# Altium project DCDC.PrjPcb (part 1 of 9)
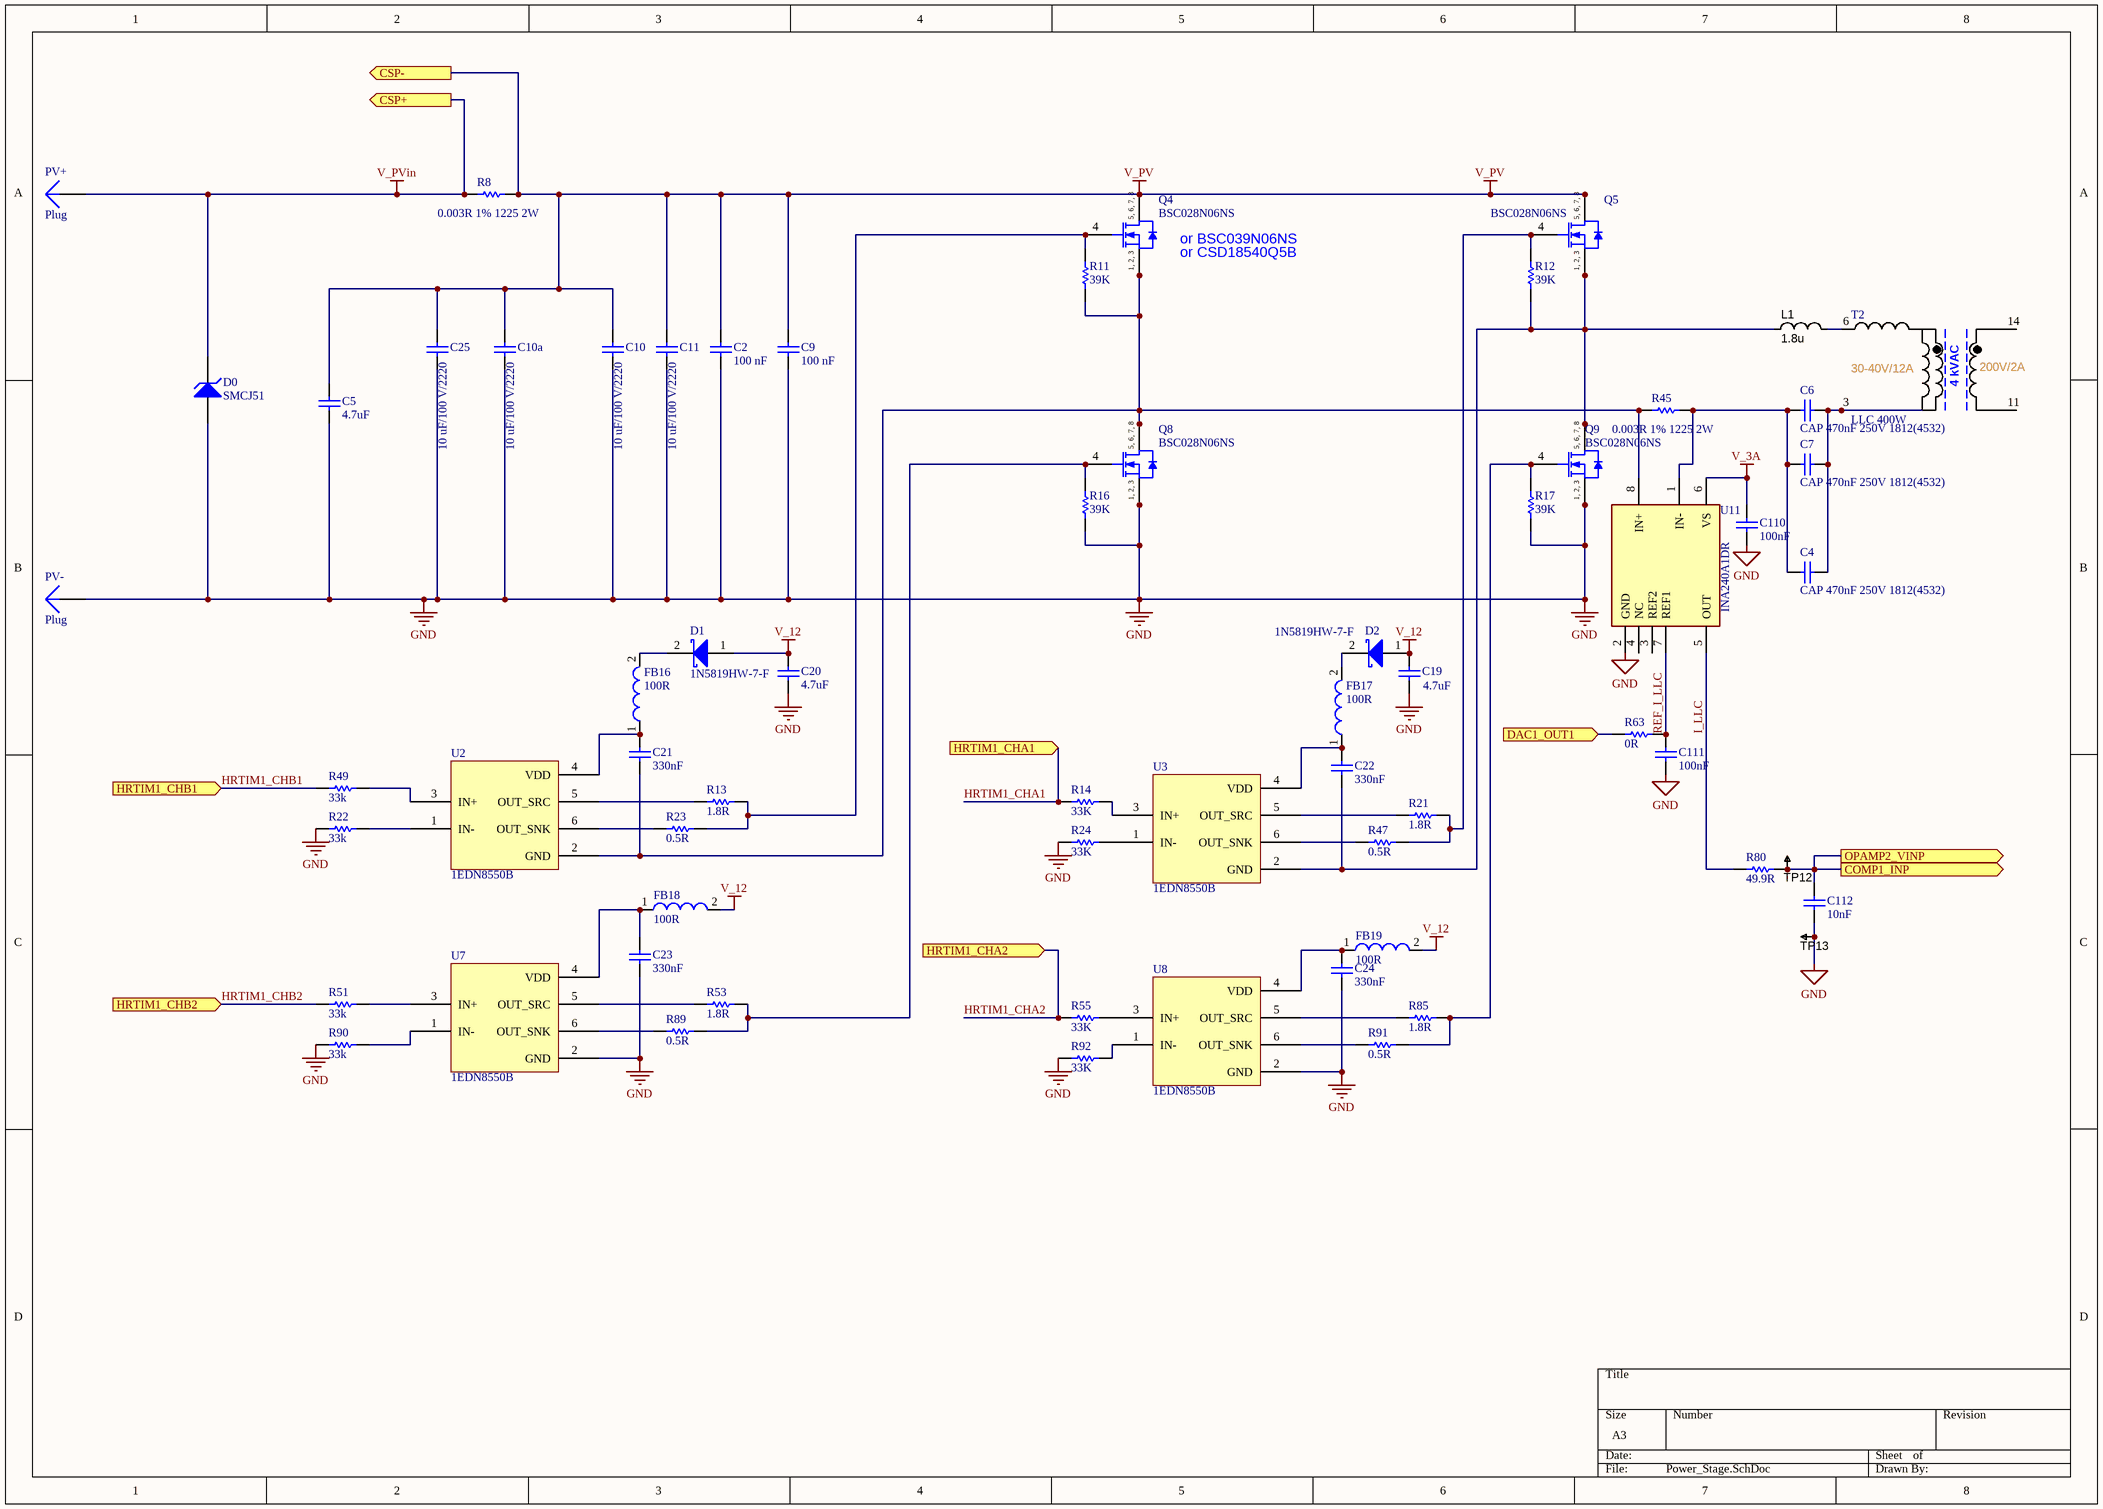
[diagram p0: Power_Stage.SchDoc]
8 sheets, 389 parts. Net scope: flat (ports and power ports of the same name join across sheets).
Board file: DCDCv1.1.PcbDoc
Sheets:
  Power_Stage.SchDoc
  MCU.SchDoc
  ISO_IO.SchDoc
  ISO_Power.SchDoc
  HV_BUCK_V2.SchDoc
  LV_BUCK.SchDoc
  CAN.SchDoc
  WIFI.SchDoc

## Sheet Power_Stage.SchDoc
size A3; SheetNumber: 1; SheetTotal: 8

### Parts
C2  100 nF  [CAPC2013X94X50NL20T25]
C4  CAP 470nF 250V 1812(4532)  [CAPC1812(4532)190_M]
C5  4.7uF  [CAPC3225X279X50NL20T25]
C6  CAP 470nF 250V 1812(4532)  [CAPC1812(4532)190_M]
C7  CAP 470nF 250V 1812(4532)  [CAPC1812(4532)190_M]
C9  100 nF  [CAPC2013X94X50NL20T25]
C10  10 uF/100 V/2220  [CAPC5750X279X64LL40T39]
C10a  10 uF/100 V/2220  [CAPC5750X279X64LL40T39]
C11  10 uF/100 V/2220  [CAPC5750X279X64LL40T39]
C19  Capacitance: 4.7uF  [CAPC3216X180X50ML20T25]  (hidden comment: C1206C105K3RACTU)
C20  Capacitance: 4.7uF  [CAPC3216X180X50ML20T25]  (hidden comment: C1206C105K3RACTU)
C21  330nF  [CAPC2013X135X45ML10T25]
C22  330nF  [CAPC2013X135X45ML10T25]
C23  330nF  [CAPC2013X135X45ML10T25]
C24  330nF  [CAPC2013X135X45ML10T25]
C25  10 uF/100 V/2220  [CAPC5750X279X64LL40T39]
C110  100nF  [CAPC1608X90X35NL10T15]
C111  100nF  [CAPC1608X90X35NL10T15]
C112  10nF  [CAPC1005X56X25NL10T15]
D0  SMCJ51  [FAIR-DO-214AB-2_V]
D1  1N5819HW-7-F  [DIOD-SOD-123-2_V]
D2  1N5819HW-7-F  [DIOD-SOD-123-2_V]
FB16  100R  [SMD-0603]
FB17  100R  [SMD-0603]
FB18  100R  [SMD-0603]
FB19  100R  [SMD-0603]
L1  1.8u  [IND LLC]
PV+  Plug  [PV_PAD]
PV-  Plug  [PV_PAD]
Q4  BSC028N06NS  [INF-PG-TDSON-8-1_V]
Q5  BSC028N06NS  [INF-PG-TDSON-8-1_V]
Q8  BSC028N06NS  [INF-PG-TDSON-8-1_V]
Q9  BSC028N06NS  [INF-PG-TDSON-8-1_V]
R8  0.003R 1% 1225 2W  [RESC3264X06N]
R11  39K  [RESC1608X55X30NL20T10]
R12  39K  [RESC1608X55X30NL20T10]
R13  1.8R  [RESC3216X70X40ML20T20]
R14  33K  [RESC1608X55X25ML10T15]
R16  39K  [RESC1608X55X30NL20T10]
R17  39K  [RESC1608X55X30NL20T10]
R21  1.8R  [RESC3216X70X40ML20T20]
R22  33k  [RESC1608X55X25ML10T15]
R23  0.5R  [RESC3216X70X40ML20T20]
R24  33K  [RESC1608X55X25ML10T15]
R45  0.003R 1% 1225 2W  [RESC3264X06N]
R47  0.5R  [RESC3216X70X40ML20T20]
R49  33k  [RESC1608X55X25ML10T15]
R51  33k  [RESC1608X55X25ML10T15]
R53  1.8R  [RESC3216X70X40ML20T20]
R55  33K  [RESC1608X55X25ML10T15]
R63  0R  [RESC1608X55X25ML10T15]
R80  49.9R  [RESC1608X55X30ML15T15]
R85  1.8R  [RESC3216X70X40ML20T20]
R89  0.5R  [RESC3216X70X40ML20T20]
R90  33k  [RESC1608X55X25ML10T15]
R91  0.5R  [RESC3216X70X40ML20T20]
R92  33K  [RESC1608X55X25ML10T15]
T2  LLC 400W  [ETD39-K-V-16P-HORIZONTAL-PRI]
TP12  TESTPOINT  [TP-R60]  (value not drawn)  (no BOM)
TP13  TESTPOINT  [TP-R60]  (value not drawn)  (no BOM)
U2  1EDN8550B  [SOT23-6]
U3  1EDN8550B  [SOT23-6]
U7  1EDN8550B  [SOT23-6]
U8  1EDN8550B  [SOT23-6]
U11  INA240A1DR  [SOIC127P600X175-8AN]

### Ports
COMP1_INP (out), CSP+ (out), CSP- (out), DAC1_OUT1 (in), HRTIM1_CHA1 (in), HRTIM1_CHA2 (in), HRTIM1_CHB1 (in), HRTIM1_CHB2 (in), OPAMP2_VINP (out)

### Nets
GND: C2.1 C5.1 C9.1 C10.1 C10a.1 C11.1 C19.1 C20.1 C23.1 C24.1 C25.1 C110.1 C111.1 C112.1 D0.1(A) PV-.1 Q8.1(SOURCE) Q8.2(SOURCE) Q8.3(SOURCE) Q9.1(SOURCE) Q9.2(SOURCE) Q9.3(SOURCE) R16.1 R17.1 R22.1 R24.1 R90.1 R92.1 TP13.1 U7.2(GND) U8.2(GND) U11.2(GND)
V_3A: C110.2 U11.6(VS)
V_12: C19.2 C20.2 D1.1(A) D2.1(A) FB18.2 FB19.2
V_PV: C2.2 C5.2 C9.2 C10.2 C10a.2 C11.2 C25.2 Q4.5(DRAIN) Q4.6(DRAIN) Q4.7(DRAIN) Q4.8(DRAIN) Q5.5(DRAIN) Q5.6(DRAIN) Q5.7(DRAIN) Q5.8(DRAIN) R8.2 ; port CSP-
V_PVin: D0.2(K) PV+.1 R8.1 ; port CSP+
COMP1_INP: C112.2 R80.2 TP12.1 ; port OPAMP2_VINP, port COMP1_INP
DAC1_OUT1: R63.1 ; port DAC1_OUT1
HRTIM1_CHA1: R14.1 ; port HRTIM1_CHA1
HRTIM1_CHA2: R55.1 ; port HRTIM1_CHA2
HRTIM1_CHB1: R49.1 ; port HRTIM1_CHB1
HRTIM1_CHB2: R51.1 ; port HRTIM1_CHB2
I_LLC: R80.1 U11.5(OUT)
REF_I_LLC: C111.2 R63.2 U11.7(REF1)
NetC4_1: C4.1 C6.1 C7.1 R45.2 U11.1(IN-)
NetC4_2: C4.2 C6.2 C7.2 T2.3
NetC21_1: C21.1 Q4.1(SOURCE) Q4.2(SOURCE) Q4.3(SOURCE) Q8.5(DRAIN) Q8.6(DRAIN) Q8.7(DRAIN) Q8.8(DRAIN) R11.1 R45.1 U2.2(GND) U11.8(IN+)
NetC21_2: C21.2 FB16.1 U2.4(VDD)
NetC22_1: C22.1 L1.1 Q5.1(SOURCE) Q5.2(SOURCE) Q5.3(SOURCE) Q9.5(DRAIN) Q9.6(DRAIN) Q9.7(DRAIN) Q9.8(DRAIN) R12.1 U3.2(GND)
NetC22_2: C22.2 FB17.1 U3.4(VDD)
NetC23_2: C23.2 FB18.1 U7.4(VDD)
NetC24_2: C24.2 FB19.1 U8.4(VDD)
NetD1_2: D1.2(K) FB16.2
NetD2_2: D2.2(K) FB17.2
NetL1_2: L1.2 T2.6
NetQ4_4: Q4.4(GATE) R11.2 R13.2 R23.2
NetQ5_4: Q5.4(GATE) R12.2 R21.2 R47.2
NetQ8_4: Q8.4(GATE) R16.2 R53.2 R89.2
NetQ9_4: Q9.4(GATE) R17.2 R85.2 R91.2
NetR13_1: R13.1 U2.5(OUT_SRC)
NetR14_2: R14.2 U3.3(IN+)
NetR21_1: R21.1 U3.5(OUT_SRC)
NetR22_2: R22.2 U2.1(IN-)
NetR23_1: R23.1 U2.6(OUT_SNK)
NetR24_2: R24.2 U3.1(IN-)
NetR47_1: R47.1 U3.6(OUT_SNK)
NetR49_2: R49.2 U2.3(IN+)
NetR51_2: R51.2 U7.3(IN+)
NetR53_1: R53.1 U7.5(OUT_SRC)
NetR55_2: R55.2 U8.3(IN+)
NetR85_1: R85.1 U8.5(OUT_SRC)
NetR89_1: R89.1 U7.6(OUT_SNK)
NetR90_2: R90.2 U7.1(IN-)
NetR91_1: R91.1 U8.6(OUT_SNK)
NetR92_2: R92.2 U8.1(IN-)

Not connected (* = marked no-connect by the designer): T2 11 14; U11 3(REF2) 4(NC)

### Notes on the sheet
- (near Q4) or BSC039N06NS
- (near Q4) or CSD18540Q5B
- (in symbol CMP-1091-00043-1) 5, 6, 7, 8; 1, 2, 3
- (in symbol TI-ETD39-200V-2A-LLC) 30-40V/12A; 200V/2A; 4 kVAC

### Library data of the parts
C2 C9 = CMP-1036-04427-2: X7R 100nF ±10% 100V 0805 Multilayer Ceramic Capacitors MLCC - SMD/SMT ROHS; Manufacturer: AVX Interconnect / Elco; Part Number: 08051C104JAT2A; Manufacturer Part Number: CL21B104KCFNNNE; Tolerance: 5%; Dissipation Factor: 2.5%; Supplier 1: RSComponents; Supplier Part Number 1: 1356664; RoHS: Yes; Category: Ceramic Capacitors; Stock 1: 1; Pricing 1: 100=0.13700, 500=0.12500, 1000=0.11100 (USD); Mount: Surface Mount; Case/Package: 0805; Number of Pins: 2; Case Code (Metric): 2012; Case Code (Imperial): 0805; Min Operating Temperature: -55°C; Max Operating Temperature: 125°C; Package Quantity: 1; Capacitance: 100nF; Voltage Rating: 100V; Packaging: Tape and Reel; Voltage Rating (DC): 100V; Dielectric: X7R; Series: -; Termination: SMD/SMT; Construction: Flat; Voltage: 100V; Length: 2.01mm; Width: 0.049inch; Height: 1.4mm; Thickness: 0.055inch; Depth: 1.25mm; Radiation Hardening: No; RoHS Compliant: Yes; REACH SVHC: No SVHC; Lead Free: Lead Free; ComponentLink1URL: https://datasheet.ciiva.com/152/cx7r-152288.pdf?src-supplier=Digi-Key; ComponentLink1Description: https://datasheet.ciiva.com/152/cx7r-152288.pdf?src-supplier=Digi-Key; ComponentLink2URL: https://datasheet.ciiva.com/152/cx7r-152289.pdf?src-supplier=Digi-Key; ComponentLink2Description: https://datasheet.ciiva.com/152/cx7r-152289.pdf?src-supplier=Digi-Key; ComponentLink3URL: https://datasheet.ciiva.com/11504/cx7r-11504232.pdf?src-supplier=Avnet; ComponentLink3Description: https://datasheet.ciiva.com/11504/cx7r-11504232.pdf?src-supplier=Avnet; ComponentLink4URL: https://datasheet.ciiva.com/16326/cx7r-16326744.pdf?src-supplier=Future+Electronics; ComponentLink4Description: https://datasheet.ciiva.com/16326/cx7r-16326744.pdf?src-supplier=Future+Electronics; ComponentLink5URL: https://datasheet.ciiva.com/22676/1679506-22676600.pdf?src-supplier=Element14; ComponentLink5Description: https://datasheet.ciiva.com/22676/1679506-22676600.pdf?src-supplier=Element14; ComponentLink6URL: https://datasheet.ciiva.com/5427/cx7r-218113-5427354.pdf?src-supplier=Mouser; ComponentLink6Description: https://datasheet.ciiva.com/5427/cx7r-218113-5427354.pdf?src-supplier=Mouser; ComponentLink7URL: https://datasheet.ciiva.com/16625/cx7r-16625228.pdf?src-supplier=Avnet+Europe; ComponentLink7Description: https://datasheet.ciiva.com/16625/cx7r-16625228.pdf?src-supplier=Avnet+Europe; ComponentLink8URL: https://datasheet.ciiva.com/152/cx7r-152287.pdf?src-supplier=Digi-Key; ComponentLink8Description: https://datasheet.ciiva.com/152/cx7r-152287.pdf?src-supplier=Digi-Key; ComponentLink9URL: https://datasheet.ciiva.com/28613/1679506-28613087.pdf?src-supplier=Element14; ComponentLink9Description: https://datasheet.ciiva.com/28613/1679506-28613087.pdf?src-supplier=Element14; JLCPCB Part #: C28233; Parameter 1: *
C4 C6 C7 = CMP-1040-01559-1: CAP 470nF 250V ±10% 1812 (4532 Metric) Thickness 1.9mm SMD; Case-Metric: 4532; Case-EIA: 1812; Tolerance: Â±10%; Max Thickness: 1.9 mm; Technology: SMT; Rated Voltage: 250 V; Value: 470nF; Parameter 1: *; JLCPCB Part #: *
C5 = CMP-2000-05478-1: Ceramic Capacitor, 100 V, 4.7 uF, +/-10%, -55 to 85 degC, 2-Pin SMD (1210), RoHS, Tape and Reel; Temperature Coefficient / Code: +/-15%; Case Height: 2.79mm; Brand: AVX; Case Width: 2.5mm; Tolerance: 10%; Capacitance: 22uF; Voltage Rating: 25V; Dielectric: X5R; Case Length: 3.2mm; Type: StandardX5RMLCCs; Case Code - in: 1210; Packaging: Reel; Minimum Operating Temperature: -55C; Package Reference: 1210; Product Category: MultilayerCeramicCapacitorsMLCC-SMD/SMT; Package / Case: 1210(3225metric); Dimensions: 2.5mmWx3.2mmLx2.79mmH; RoHS: Details; Manufacturer: AVX; Case Code - mm: 3225; Maximum Operating Temperature: +85C; Operating Temperature Range: -55Cto+85C; Mounting Technology: SurfaceMount; Product: GeneralTypeMLCCs; Manufacturer URL: http://www.avx.com/; Termination Style: SMD/SMT; Package Description: 2-Pin Surface Mount Device, Body 3.2 x 2.5 mm; Datasheet URL: http://datasheets.avx.com/cx5r.pdf; Datasheet Version: 05/2016; Voltage Rating DC: 25V; Factory Pack Quantity: 1000; Parameter 1: *; JLCPCB Part #: *
C10 C10a C11 C25 = CMP-2000-07534-1: Chip Capacitor, 10 uF, +/- 20%, 100 V, -55 to 125 degC, 2220 (5750 Metric), RoHS, Tape and Reel; Manufacturer: AVX; Manufacturer Part Number: 22201C106MAT2A; Capacitance: 10uF; Voltage Rating: 100V; Dielectric: X7R; Datasheet URL: http://datasheets.avx.com/X7RDielectric.pdf; Package Reference: 2220; Package Description: 2-Pin Surface Mount Device, Body 5 x 5.7 mm; Datasheet Version: 03/2017; Manufacturer URL: http://www.avx.com/; Mounting Technology: SurfaceMount; Supplier 1: Digi-Key; Supplier Part Number 1: 478-9622-1-ND; Stock 1: 129916; Pricing 1: 1=2,26000, 10=1,82600, 100=1,39470 (USD); RoHS: Yes; Mount: Surface Mount; Case/Package: 2220; Case Code (Metric): 5750; Case Code (Imperial): 2220; Min Operating Temperature: -55°C; Max Operating Temperature: 125°C; Packaging: Tape and Reel; Tolerance: 20%; Voltage Rating (DC): 100V; Length: 0.224inch; Width: 0.197inch; Thickness: 0.11inch; ComponentLink1URL: http://catalogs.avx.com/SurfaceMount.pdf?src-supplier=Digi-Key; ComponentLink1Description: http://catalogs.avx.com/SurfaceMount.pdf?src-supplier=Digi-Key; Parameter 1: *; JLCPCB Part #: *
C19 C20 = CMP-2000-04991-1: X7R ±10% 50V 4.7uF 1206 Multilayer Ceramic Capacitors MLCC - SMD/SMT ROHS; Manufacturer: Kemet; Temperature Coefficient / Code: +/-15%; Voltage Rating DC: 25V; Capacitance - nF: 1000nF; Class: Class1; Case Length: 3.2mm; Type: SMDMLCCX7R6.3-250VDCCommericalGrade; Case Width: 1.6mm; Product: GeneralTypeMLCCs; Dielectric: X7R; Datasheet URL: https://ciiva.com/datasheet-click-18194173?src=ciiva&sig=6daff8c4; Operating Temperature Range: -55Cto+125C; Series: C1206C; RoHS: Details; Product Category: MultilayerCeramicCapacitorsMLCC-SMD/SMT; Manufacturer URL: http://www.kemet.com/; Minimum Operating Temperature: -55C; Dimensions: 1.6mmWx3.2mmLx1.6mmH; Termination Style: SMD/SMT; Brand: Kemet; Packaging: Reel; Package / Case: 1206(3216metric); Case Code - mm: 3216; Datasheet Version: Jul-14; Factory Pack Quantity: 2000; Package Description: 2-Pin Surface Mount Device, Body 3.2 x 1.6 mm; Tolerance: 10%; Package Reference: 1206; Case Height: 1.6mm; Case Code - in: 1206; Maximum Operating Temperature: +125C; Voltage Rating: 25V; Parameter 1: *; JLCPCB Part #: C29823
C21-C24 = CMP-2100-03644-1: X7R ±10% 50V 330nF 0805 Multilayer Ceramic Capacitors MLCC - SMD/SMT ROHS; Manufacturer: Murata; Manufacturer Part Number: GRM21BR71H104KA01L; Capacitance: 100nF; Insulation Resistance: 10GR; Package Description: 2-Pin Surface Mount Device, Body 2 x 1.25 mm; Manufacturer URL: http://www.murata.com/; Case Code (Imperial): 0805; Voltage: 50V; Datasheet URL: http://psearch.en.murata.com/capacitor/product/GRM21BR71H104KA01%23.pdf; Termination: SMD/SMT; Lead Free: LeadFree; Package Quantity: 1; Mount: SurfaceMount; REACH SVHC: Unknown; Thickness: 0.053inch; Height: 1.25mm; Case/Package: 0805; Voltage Rating: 50V; Dielectric Material: Ceramic; Width: 0.049inch; Case Code (Metric): 2012; Material: Ceramic; Min Operating Temperature: -55degC; RoHSCompliant: true; Datasheet Version: 42675.0; Voltage Rating (DC): 50V; Tolerance: 10%; Dielectric: X7R; Package Reference: 0805; Depth: 1.25mm; Length: 2mm; Max Operating Temperature: 125degC; Packaging: TapeandReel; Number of Pins: 2; Radiation Hardening: No; Supplier 1: Farnell; Supplier Part Number 1: 2408531; RoHS: Yes; Category: Ceramic Capacitors; Stock 1: 576000; ComponentLink1URL: https://datasheet.ciiva.com/11786/0900766b8003061f-11786305.pdf?src-supplier=RSComponents; ComponentLink1Description: https://datasheet.ciiva.com/11786/0900766b8003061f-11786305.pdf?src-supplier=RSComponents; ComponentLink2URL: https://datasheet.ciiva.com/20173/71-2024-20173169.pdf?src-supplier=Rapid+Electronics; ComponentLink2Description: https://datasheet.ciiva.com/20173/71-2024-20173169.pdf?src-supplier=Rapid+Electronics; ComponentLink3URL: https://datasheet.ciiva.com/29200/453120-da-01-en-vs-kondensator-0805-29200537.pdf?src-supplier=Conrad; ComponentLink3Description: https://datasheet.ciiva.com/29200/453120-da-01-en-vs-kondensator-0805-29200537.pdf?src-supplier=Conrad; ComponentLink4URL: https://datasheet.ciiva.com/132/partnumbering-e-01-132209.pdf?src-supplier=Digi-Key; ComponentLink4Description: https://datasheet.ciiva.com/132/partnumbering-e-01-132209.pdf?src-supplier=Digi-Key; ComponentLink5URL: https://datasheet.ciiva.com/132/partnumbering-e-01-132210.pdf?src-supplier=Digi-Key; ComponentLink5Description: https://datasheet.ciiva.com/132/partnumbering-e-01-132210.pdf?src-supplier=Digi-Key; ComponentLink6URL: https://datasheet.ciiva.com/132/partnumbering-e-01-132211.pdf?src-supplier=Digi-Key; ComponentLink6Description: https://datasheet.ciiva.com/132/partnumbering-e-01-132211.pdf?src-supplier=Digi-Key; ComponentLink7URL: https://datasheet.ciiva.com/7937/1794405-7937708.pdf?src-supplier=Element14; ComponentLink7Description: https://datasheet.ciiva.com/7937/1794405-7937708.pdf?src-supplier=Element14; ComponentLink8URL: https://datasheet.ciiva.com/7937/1794405-7937709.pdf?src-supplier=Element14; ComponentLink8Description: https://datasheet.ciiva.com/7937/1794405-7937709.pdf?src-supplier=Element14; ComponentLink9URL: https://datasheet.ciiva.com/28534/1769893-28534317.pdf?src-supplier=Element14; ComponentLink9Description: https://datasheet.ciiva.com/28534/1769893-28534317.pdf?src-supplier=Element14; ComponentLink10URL: https://datasheet.ciiva.com/7937/4360-7937710.pdf?src-supplier=Element14; ComponentLink10Description: https://datasheet.ciiva.com/7937/4360-7937710.pdf?src-supplier=Element14; Parameter 1: *; JLCPCB Part #: C1740
C110 C111 = CAP: X7R 100nF ±10% 50V 0603 Multilayer Ceramic Capacitors MLCC - SMD/SMT ROHS; Part Number: GCM188R72A104KA64D; Manufacturer: Murata; Manufacturer Part Number: CC0603KRX7R9BB104; Voltage Rating: 100V; Supplier 1: Arrow Electronics; Supplier Part Number 1: GCM188R72A104KA64D; RoHS: Yes; Category: Ceramic Capacitors; Mount: Surface Mount; Case/Package: 0603; Case Code (Imperial): 0603; Case Code (Metric): 1608; Min Operating Temperature: -55°C; Max Operating Temperature: 125°C; Tolerance: 10%; Packaging: Tape and Reel; Capacitance: 100nF; Dielectric: X7R; Termination: SMD/SMT; Voltage Rating (DC): 100V; Length: 1.6mm; Height: 0.8mm; Depth: 0.8mm; Radiation Hardening: No; ComponentLink1URL: https://datasheet.ciiva.com/17451/product-17451047.pdf?src-supplier=Avnet+Europe; ComponentLink1Description: https://datasheet.ciiva.com/17451/product-17451047.pdf?src-supplier=Avnet+Europe; ComponentLink2URL: https://datasheet.ciiva.com/26889/getdatasheetpartid-387765-26889164.pdf?src-supplier=Verical; ComponentLink2Description: https://datasheet.ciiva.com/26889/getdatasheetpartid-387765-26889164.pdf?src-supplier=Verical; Parameter 1: *; JLCPCB Part #: C14663
C112 = CAP: X7R ±10% 50V 10nF 0603 Multilayer Ceramic Capacitors MLCC - SMD/SMT ROHS; Manufacturer: AVX Interconnect / Elco; Part Number: 04023C103JAT2A; Tolerance: 5%; Voltage Rating: 25V; Supplier 1: Digi-Key; Supplier Part Number 1: 478-7867-1-ND; Manufacturer Part Number: 04023C103JAT2A; RoHS: Yes; Category: Ceramic Capacitors; Stock 1: 9159; Pricing 1: 1=0.35000, 10=0.24300, 50=0.16980, 100=0.14560, 500=0.10920, 1000=0.09221, 2500=0.08735, 5000=0.08250 (USD); Mount: Surface Mount; Case/Package: 0402; Number of Pins: 2; Case Code (Imperial): 0402; Case Code (Metric): 1005; Min Operating Temperature: -55°C; Max Operating Temperature: 125°C; Packaging: Tape and Reel; Capacitance: 10nF; Package Quantity: 1; Voltage Rating (DC): 25V; Dielectric: X7R; Termination: SMD/SMT; Series: -; Construction: Flat; Length: 1mm; Width: 0.5mm; Thickness: 0.022inch; Depth: 0.5mm; Radiation Hardening: No; RoHS Compliant: Yes; Lead Free: Lead Free; ComponentLink1URL: https://datasheet.ciiva.com/11499/cx7r-11499815.pdf?src-supplier=Avnet; ComponentLink1Description: https://datasheet.ciiva.com/11499/cx7r-11499815.pdf?src-supplier=Avnet; ComponentLink2URL: https://datasheet.ciiva.com/5424/cx7r-218113-5424201.pdf?src-supplier=Mouser; ComponentLink2Description: https://datasheet.ciiva.com/5424/cx7r-218113-5424201.pdf?src-supplier=Mouser; ComponentLink3URL: https://datasheet.ciiva.com/7614/cx7r-7614730.pdf?src-supplier=Digi-Key; ComponentLink3Description: https://datasheet.ciiva.com/7614/cx7r-7614730.pdf?src-supplier=Digi-Key; ComponentLink4URL: https://datasheet.ciiva.com/208/cx7r-208205.pdf?src-supplier=Digi-Key; ComponentLink4Description: https://datasheet.ciiva.com/208/cx7r-208205.pdf?src-supplier=Digi-Key; ComponentLink5URL: https://datasheet.ciiva.com/14906/cx7r-14906237.pdf?src-supplier=Digi-Key; ComponentLink5Description: https://datasheet.ciiva.com/14906/cx7r-14906237.pdf?src-supplier=Digi-Key; ComponentLink6URL: https://datasheet.ciiva.com/16397/cx7r-16397645.pdf?src-supplier=Future+Electronics; ComponentLink6Description: https://datasheet.ciiva.com/16397/cx7r-16397645.pdf?src-supplier=Future+Electronics; ComponentLink7URL: https://datasheet.ciiva.com/14906/cx7r-14906238.pdf?src-supplier=Digi-Key; ComponentLink7Description: https://datasheet.ciiva.com/14906/cx7r-14906238.pdf?src-supplier=Digi-Key; Parameter 1: *; JLCPCB Part #: C57112
D0 = CMP-2000-07108-1: Transient Voltage Suppressor, 1500 W, 36 V, 2-Pin SMD, RoHS, Tape and Reel; Manufacturer: Fairchild Semiconductor; Breakdown Voltage-Max: 44.2V; Directional: Uni-Directional; Clamping Voltage-Max: 58.1V; Power Dissipation: 1500W; Breakdown Voltage-Min: 40V; Datasheet Version: Rev. 5.7, 09/2015; Mounting Technology: SurfaceMount; Package Description: 2-Pin Surface Mount Device, Body 6.875 x 5.9 mm; Package Reference: DO-214AB; Manufacturer URL: https://www.fairchildsemi.com/; Datasheet URL: https://www.fairchildsemi.com/datasheets/SM/SMCJ36A.pdf; Parameter 1: *; JLCPCB Part #: *
D1 D2 = CMP-0303-00003-1: 1.0 A Surface Mount Schottky Barrier Rectifier, 40 V, -65 to 125 degC, 2-Pin SOD-123 Package, RoHS, Tape and Reel; Manufacturer: Diodes Inc; @ VR (V): 40; @ Terminal Temperature TT (degC): 90; Maximum Average Rectified Current IO (A): 1; Total Capacitance CT (pF): 50; Peak Forward Surge Current IFSM (A): 25; Forward Voltage Drop VF (V): 0.45; VR (RMS) (V): 28; RoHS: TRUE; PartNumber: 1N5819HW-7-F; ComponentLink2URL: http://www.diodes.com/datasheets/ds30217.pdf; PackageDescription: 2-Pin SOD-123, Body 2.7 x 1.55 mm, Pitch 3.7 mm; @ IF (A): 1; Operating and Storage Temperature Range: -65 to 125 degC; ComponentLink1Description: Manufacturer URL; ComponentLink2Description: Datasheet; ComponentLink1URL: http://www.diodes.com/; Mounting Technology: Surface Mount; DatasheetVersion: Rev. 15-2; PackageReference: SOD-123-2; Maximum Reverse Current IR (uA): 50; Peak Repetitive Reverse Voltage VRRM (V): 40; Packing: Tape and Reel; Parameter 1: *; JLCPCB Part #: C8598
FB16-FB19 = CMP-0220-00115-1: SMD EMI Suppression Ferrite Bead WE-CBF, Z = 1500 Ohm; DatasheetVersion: Dec-2005; ComponentLink1URL: http://www.we-online.com; PackageVersion: 2009; PackageDescription: Chip Inductor, 2-Leads, Body 1.6 x 0.8 mm; ComponentLink2URL: http://www.we-online.de/katalog/media/pdf/742792691.pdf; ComponentLink1Description: Manufacturer Link; ComponentLink2Description: Datasheet; Impedance: 1500 Ohm; PackageReference: SMD-0603; Parameter 1: *; JLCPCB Part #: *
L1 = INDC_150n_1008: Inductor SMD chip 150nH 1008; Manufacturer 1: TDK Corporation; Manufacturer Part Number 1: NLV25T-R15J-PF; Ratings: 500 mA; Tolerance: ±5%; SCDType: spec; Package / Case: 1008 (2520 Metric); Supplier 1: Digi-Key; Supplier Part Number 1: 445-1715-1-ND; Value: 1.8u; Parameter 1: *; JLCPCB Part #: *
PV+ = Plug: System: Connector; LatestRevisionDate: 17-Jul-2002; LatestRevisionNote: Re-released for DXP Platform.; Publisher: Altium Limited; Parameter 1: *; JLCPCB Part #: *
Q4 Q5 Q8 Q9 = CMP-1091-00043-1: N-Channel OptiMOS Power-Transistor, 60 V VDS, 100 A ID, -55 to 150 degC, PG-TDSON-8-1, Reel, Green; PartNumber: BSC027N06LS5; Manufacturer: Infineon; Green: TRUE; ID (max): 100Â A; RthJA (max): 50 K/W; IDpuls (max): 400Â A; VGS(th) (min): 2.1Â V; Ptot (max): 83Â W; RthJC (max): 1.5Â K/W; VDS (max): 60Â V; Polarity: N; QG: 37Â nC; VGS(th) (max): 3.3 V; RDS (on) (max): 2.8Â mOhm; ComponentLink3Description: Package Specification; ComponentLink2URL: http://www.infineon.com/dgdl/BSC028N06NS_Rev2.1.pdf?folderId=db3a30431ddc9372011ebafa04517f8b&fileId=db3a3043345a30bc013465d221bd62f9; Packing: Reel; PackageReference: PG-TDSON-8-1; PackageDescription: 8-Pin Plastic (Green) Thin Dual Small Outline Non-Leaded Package, 5.15 x 5.9 mm Body, 1.27 mm Pitch; ComponentLink1Description: Manufacturer URL; ComponentLink1URL: http://www.infineon.com/; DatasheetVersion: Rev. 2.1; Mounting Technology: Surface Mount; ComponentLink2Description: Datasheet; ComponentLink3URL: http://www.infineon.com/cms/packages/SMD_-_Surface_Mounted_Devices/P-PG-TDSON/P-PG-TDSON-08-01x_2x_3.html?__locale=en; Halogen-free: TRUE; Rth: 1.5Â K/W; Parameter 1: *; JLCPCB Part #: *
R8 R45 = RES: RES SMD 3 MOHM 3W 2512 WIDE; Manufacturer: Susumu; Manufacturer Part Number: KRL6432E-M-R003-F-T1; Resistance: 3mR; Temperature Coefficient: 50ppm/°C; Supplier 1: Digi-Key; Supplier Part Number 1: 408-1613-1-ND; RoHS: Yes; Category: Chip SMD Resistors; Stock 1: 10436; Pricing 1: 1=0.96000, 10=0.85300, 25=0.78360, 50=0.71500, 100=0.61880, 250=0.52252, 500=0.44000 (USD); Case/Package: 2512; Weight: 0.001429oz; Case Code (Imperial): 2512; Case Code (Metric): 6432; Min Operating Temperature: -55°C; Max Operating Temperature: 155°C; Power Rating: 3W; Tolerance: 1%; Packaging: Tape and Reel; Package Quantity: 1000; Termination: SMD/SMT; Composition: Metal Foil; Length: 6.3mm; Height: 0.5mm; Width: 3.1mm; ComponentLink1URL: http://www.mouser.com/ds/2/392/n_catalog_partition19_en-1114600.pdf?src-supplier=Mouser; ComponentLink1Description: http://www.mouser.com/ds/2/392/n_catalog_partition19_en-1114600.pdf?src-supplier=Mouser; ComponentLink2URL: http://www.susumu-usa.com/pdf/Foot_Print_21.pdf?src-supplier=Digi-Key; ComponentLink2Description: http://www.susumu-usa.com/pdf/Foot_Print_21.pdf?src-supplier=Digi-Key; ComponentLink3URL: http://www.susumu.co.jp/common/pdf/n_catalog_partition19_en.pdf?src-supplier=Digi-Key; ComponentLink3Description: http://www.susumu.co.jp/common/pdf/n_catalog_partition19_en.pdf?src-supplier=Digi-Key; Parameter 1: *; JLCPCB Part #: *
R11 R12 R16 R17 = CMP-2000-01851-1: ±1% 39kΩ ±100ppm/℃ 0.1W 0603 Chip Resistor - Surface Mount ROHS; Part Number: RK73B1JTTD103J; Manufacturer: KOA Speer; Resistance: 10kR; Tolerance: 5%; Power Rating: 100mW; Temperature Coefficient: 200ppm/°C; Voltage Rating: 50V; Supplier 1: Digi-Key; Supplier Part Number 1: 2019-RK73B1JTTD103JCT-ND; Manufacturer Part Number: RK73B1JTTD103J; Stock 1: 652898; Pricing 1: 1=0,10000, 10=0,01500, 100=0,00610, 1000=0,00275, 2500=0,00239 (USD); RoHS: Yes; Case/Package: 0603; Number of Pins: 2; Case Code (Imperial): 0603; Case Code (Metric): 1608; Min Operating Temperature: -55°C; Max Operating Temperature: 155°C; Packaging: Tape and Reel; Composition: Thick Film; Termination: SMD/SMT; Military Standard: Not; Package Quantity: 5000; Voltage Rating (DC): 50V; Length: 1.6mm; Height: 0.45mm; Depth: 0.8mm; Width: 0.8mm; Lead Free: Lead Free; ComponentLink1URL: https://datasheet.ciiva.com/34302/1877832-34302947.pdf?src-supplier=Jameco; ComponentLink1Description: https://datasheet.ciiva.com/34302/1877832-34302947.pdf?src-supplier=Jameco; ComponentLink2URL: https://datasheet.ciiva.com/5554/rk73b-5554408.pdf?src-supplier=Mouser; ComponentLink2Description: https://datasheet.ciiva.com/5554/rk73b-5554408.pdf?src-supplier=Mouser; ComponentLink3URL: https://datasheet.ciiva.com/7773/548635-7773278.pdf?src-supplier=Element14; ComponentLink3Description: https://datasheet.ciiva.com/7773/548635-7773278.pdf?src-supplier=Element14; Parameter 1: *; JLCPCB Part #: C23153
R13 R21 R23 R47 R53 R85 R89 R91 = CMP-2003-00929-1: Manufacturer: KOA Speer; Part Number: RK73B2BTTD4R7J; Parameter 1: *; JLCPCB Part #: *
R14 R22 R24 R49 R51 R55 R90 R92 = CMP-2100-03663-1: Chip Resistor, 100 Ohm, +/- 1%, 0.1 W, -55 to 155 degC, 0603 (1608 Metric), RoHS, Tape and Reel; Manufacturer: Yageo; Manufacturer Part Number: RC0603FR-07100RL; Voltage Rating (DC): 50V; Power Rating: 100mW; Resistance: 100Ohm; Temperature Coefficient: 100ppm/degreesC; Number of Pins: 2; Tolerance: 1%; Height: 0.45mm; Manufacturer URL: http://www.yageo.com/; Military Standard: Not; Datasheet URL: http://www.yageo.com/NewPortal/yageodocoutput?fileName=/pdf/R-Chip/PYu-RC_Group_51_RoHS_L_5.pdf; Case Code (Imperial): 0603; Termination: SMD/SMT; Lead Free: LeadFree; Max Operating Temperature: 155degC; Case Code (Metric): 1608; RoHSCompliant: true; Voltage Rating: 50V; Width: 0.8mm; Composition: ThickFilm; Depth: 0.8mm; REACH SVHC: Unknown; Min Operating Temperature: -55degC; Packaging: TapeandReel; Package Description: 2-Pin Surface Mount Device, Body 1.6 x 0.8 mm; Length: 1.6mm; Package Reference: 0603; Datasheet Version: Rev. 5, 10/2016; Case/Package: 0603; Supplier 1: Digi-Key; Supplier Part Number 1: 311-100HRDKR-ND; RoHS: Yes; Category: Chip SMD Resistors; Stock 1: 21618328; Pricing 1: 1=0.10000, 10=0.02300, 100=0.00940, 1000=0.00421, 2500=0.00366 (USD); ComponentLink1URL: https://datasheet.ciiva.com/7660/38590-7660788.pdf?src-supplier=Element14; ComponentLink1Description: https://datasheet.ciiva.com/7660/38590-7660788.pdf?src-supplier=Element14; ComponentLink2URL: https://datasheet.ciiva.com/11808/0900766b80f96399-11808280.pdf?src-supplier=RSComponents; ComponentLink2Description: https://datasheet.ciiva.com/11808/0900766b80f96399-11808280.pdf?src-supplier=RSComponents; ComponentLink3URL: https://datasheet.ciiva.com/46440/1868787-46440890.pdf?src-supplier=Element14; ComponentLink3Description: https://datasheet.ciiva.com/46440/1868787-46440890.pdf?src-supplier=Element14; ComponentLink4URL: https://datasheet.ciiva.com/7746/1738695-7746237.pdf?src-supplier=Element14; ComponentLink4Description: https://datasheet.ciiva.com/7746/1738695-7746237.pdf?src-supplier=Element14; ComponentLink5URL: https://datasheet.ciiva.com/7746/1738695-7746238.pdf?src-supplier=Element14; ComponentLink5Description: https://datasheet.ciiva.com/7746/1738695-7746238.pdf?src-supplier=Element14; ComponentLink6URL: https://datasheet.ciiva.com/22747/443971-22747518.pdf?src-supplier=Element14; ComponentLink6Description: https://datasheet.ciiva.com/22747/443971-22747518.pdf?src-supplier=Element14; Parameter 1: *; JLCPCB Part #: *
R63 = CMP-2100-03667-1: ±1% 0Ω 0.1W 0603 Chip Resistor - Surface Mount ROHS; Manufacturer: Yageo; Temperature Coefficient: 200ppm/degreesC; Tolerance: 5%; Voltage Rating: 50V; Power Rating: 100mW; Resistance: 0mOhm; Width: 0.8mm; Max Operating Temperature: 155degC; Package Reference: 0603; Height: 0.45mm; Depth: 0.8mm; Package Description: 2-Pin Surface Mount Device, Body 1.6 x 0.8 mm; Termination: SMD/SMT; Package Quantity: 5000; Case/Package: 0603; Case Code (Imperial): 0603; Radiation Hardening: No; Number of Pins: 2; Length: 1.6mm; Lead Free: LeadFree; Voltage Rating (DC): 50V; Military Standard: Not; Datasheet URL: http://www.yageo.com/NewPortal/yageodocoutput?fileName=/pdf/R-Chip/PYu-RC_Group_51_RoHS_L_5.pdf; Manufacturer URL: http://www.yageo.com/; Packaging: TapeandReel; Case Code (Metric): 1608; Min Operating Temperature: -55degC; Composition: ThickFilm; RoHSCompliant: true; Contact Plating: Tin; Datasheet Version: Rev. 5, 10/2016; REACH SVHC: NoSVHC; Parameter 1: *; JLCPCB Part #: C21189
R80 = CMP-2000-00538-1: ±1% ±200ppm/℃ 0.1W 49.9Ω 0603 Chip Resistor - Surface Mount ROHS; Manufacturer: Panasonic; Part Number: ERJ-3EKF49R9V; Manufacturer Part Number: ERJ3EKF49R9V; Power Rating: 100mW; Voltage Rating: 75V; Temperature Coefficient: 100ppm/°C; Voltage Rating (DC): 50V; Working Voltage: 6V; Supplier 1: RSComponents; Supplier Part Number 1: 1229343; RoHS: Yes; Category: Chip SMD Resistors; Stock 1: 1; Pricing 1: 5000=0.00700 (USD); Mount: Surface Mount; Case/Package: 0603; Case Code (Imperial): 0603; Case Code (Metric): 1608; Contact Plating: Tin; Min Operating Temperature: -55°C; Max Operating Temperature: 155°C; Packaging: Tape and Reel; Resistance: 49.9R; Tolerance: 1%; Resistor Type: Thick Film; Number of Terminations: 2; Termination: SMD/SMT; Max Power Dissipation: 100mW; Series: ERJ; Package Quantity: 5000; Resistance Tolerance: 1%; Features: Automotive AEC-Q200; Construction: Rectangular; Technology: THICK FILM; Length: 1.6mm; Width: 0.8mm; Height: 0.022inch; Depth: 0.8mm; Radiation Hardening: No; REACH SVHC: Unknown; Lead Free: Lead Free; RoHS Compliant: Yes; Military Standard: Not; ComponentLink1URL: https://datasheet.ciiva.com/46388/1678782-46388908.pdf?src-supplier=Element14; ComponentLink1Description: https://datasheet.ciiva.com/46388/1678782-46388908.pdf?src-supplier=Element14; ComponentLink2URL: https://datasheet.ciiva.com/28694/1678782-28694219.pdf?src-supplier=Element14; ComponentLink2Description: https://datasheet.ciiva.com/28694/1678782-28694219.pdf?src-supplier=Element14; ComponentLink3URL: https://datasheet.ciiva.com/16772/70260748-16772570.pdf?src-supplier=Allied+Electronics; ComponentLink3Description: https://datasheet.ciiva.com/16772/70260748-16772570.pdf?src-supplier=Allied+Electronics; ComponentLink4URL: https://datasheet.ciiva.com/16766/70260748-16766262.pdf?src-supplier=Allied+Electronics; ComponentLink4Description: https://datasheet.ciiva.com/16766/70260748-16766262.pdf?src-supplier=Allied+Electronics; ComponentLink5URL: https://datasheet.ciiva.com/9117/aoa0000ce2-9117128.pdf?src-supplier=Avnet; ComponentLink5Description: https://datasheet.ciiva.com/9117/aoa0000ce2-9117128.pdf?src-supplier=Avnet; ComponentLink6URL: https://datasheet.ciiva.com/48531/aoa0000ce2-48531019.pdf?src-supplier=Avnet; ComponentLink6Description: https://datasheet.ciiva.com/48531/aoa0000ce2-48531019.pdf?src-supplier=Avnet; ComponentLink7URL: https://datasheet.ciiva.com/30095/aoa0000ce2-30095355.pdf?src-supplier=Onlinecomponents.com; ComponentLink7Description: https://datasheet.ciiva.com/30095/aoa0000ce2-30095355.pdf?src-supplier=Onlinecomponents.com; Parameter 1: *; JLCPCB Part #: C23185
T2 = TI-ETD39-200V-2A-LLC: Lr=1.9uH / Lm=10.2uH / n=5.7 / Vin=30-40V / Vout=200V; Parameter 1: *; JLCPCB Part #: *
TP12 TP13 = TESTPOINT: SMD test pin
U2 U3 U7 U8 = 1EDN8550B: Single-channel EiceDRIVER™ with true  differential inputs; Parameter 1: *; JLCPCB Part #: *
U11 = a9db4a8a3d73c22b64f8e8a0c239388: IC CURR SENSE 1 CIRCUIT 8SOIC; Slew Rate: 2V/µs; -3db Bandwidth: 400kHz; Input Bias Current: 90uA; Operating Supply Current: 1.8mA; Input Offset Voltage (Vos): 5uV; Number of Circuits: 1; Mount: Surface Mount; Packaging: Cut Tape; Max Operating Temperature: 125°C; Case/Package: SOIC; Min Operating Temperature: -40°C; RoHS Compliant: Yes; Number of Pins: 8; Parameter 1: *; JLCPCB Part #: *
PV- = Plug: LatestRevisionDate: 17-Jul-2002; LatestRevisionNote: Re-released for DXP Platform.; Publisher: Altium Limited; Parameter 1: *; JLCPCB Part #: *

## Sheet MCU.SchDoc
size A2; SheetNumber: 2; SheetTotal: 8
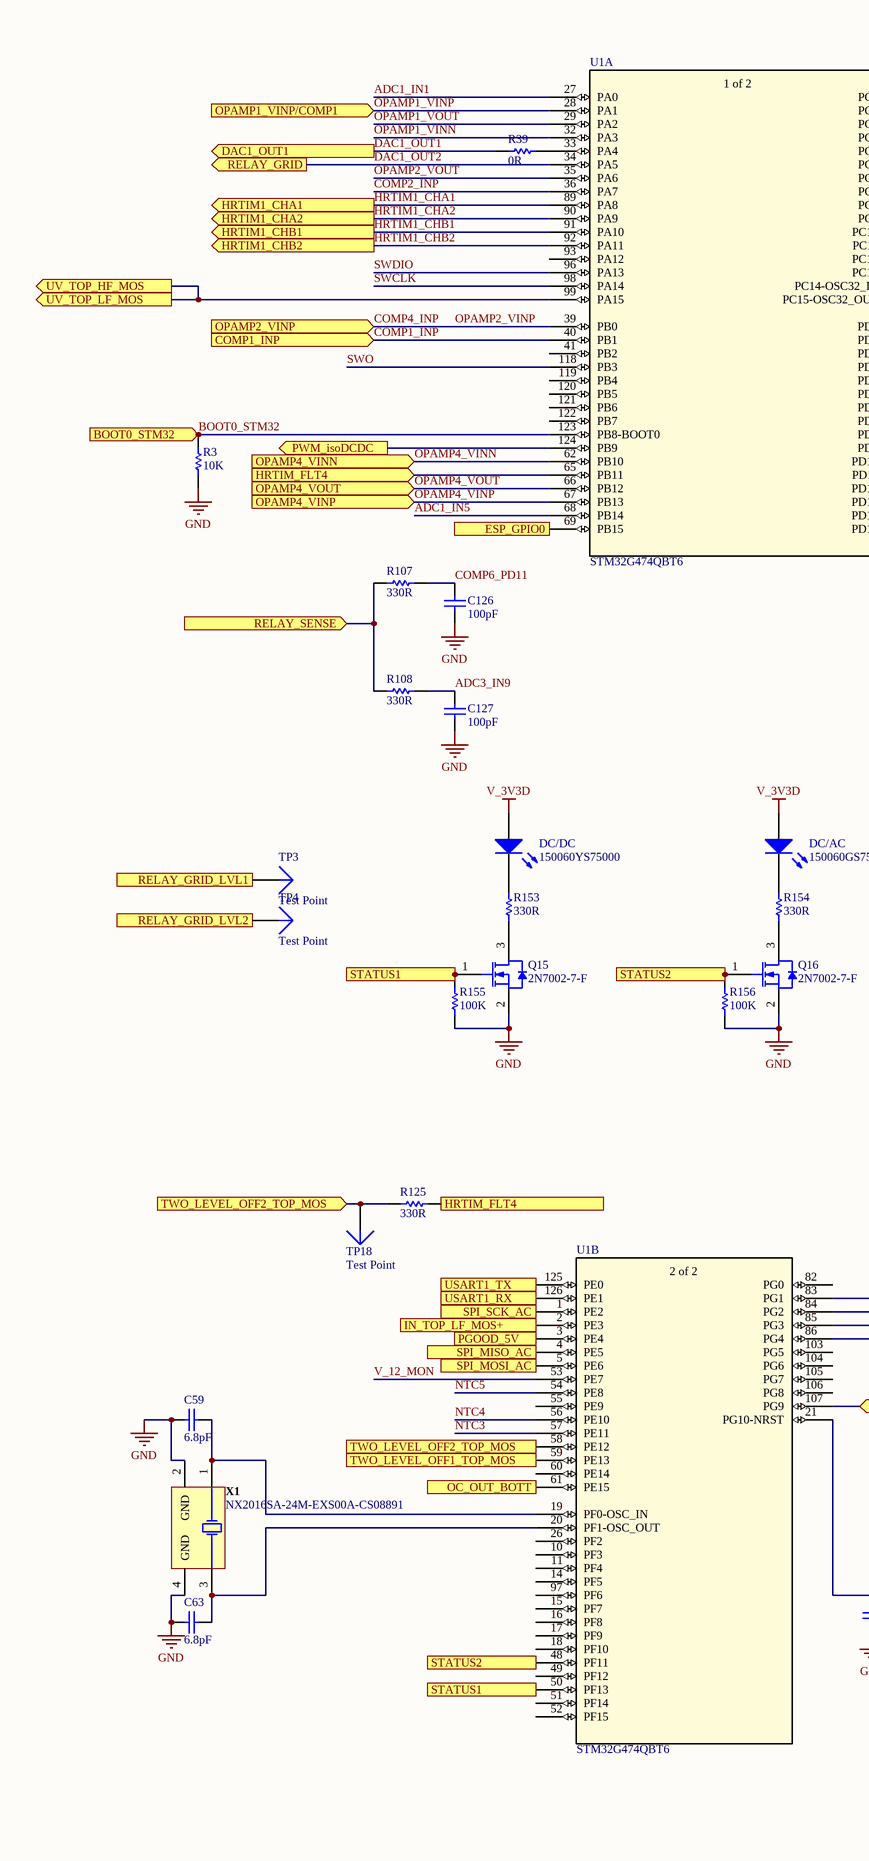
[diagram p1: MCU.SchDoc, left]
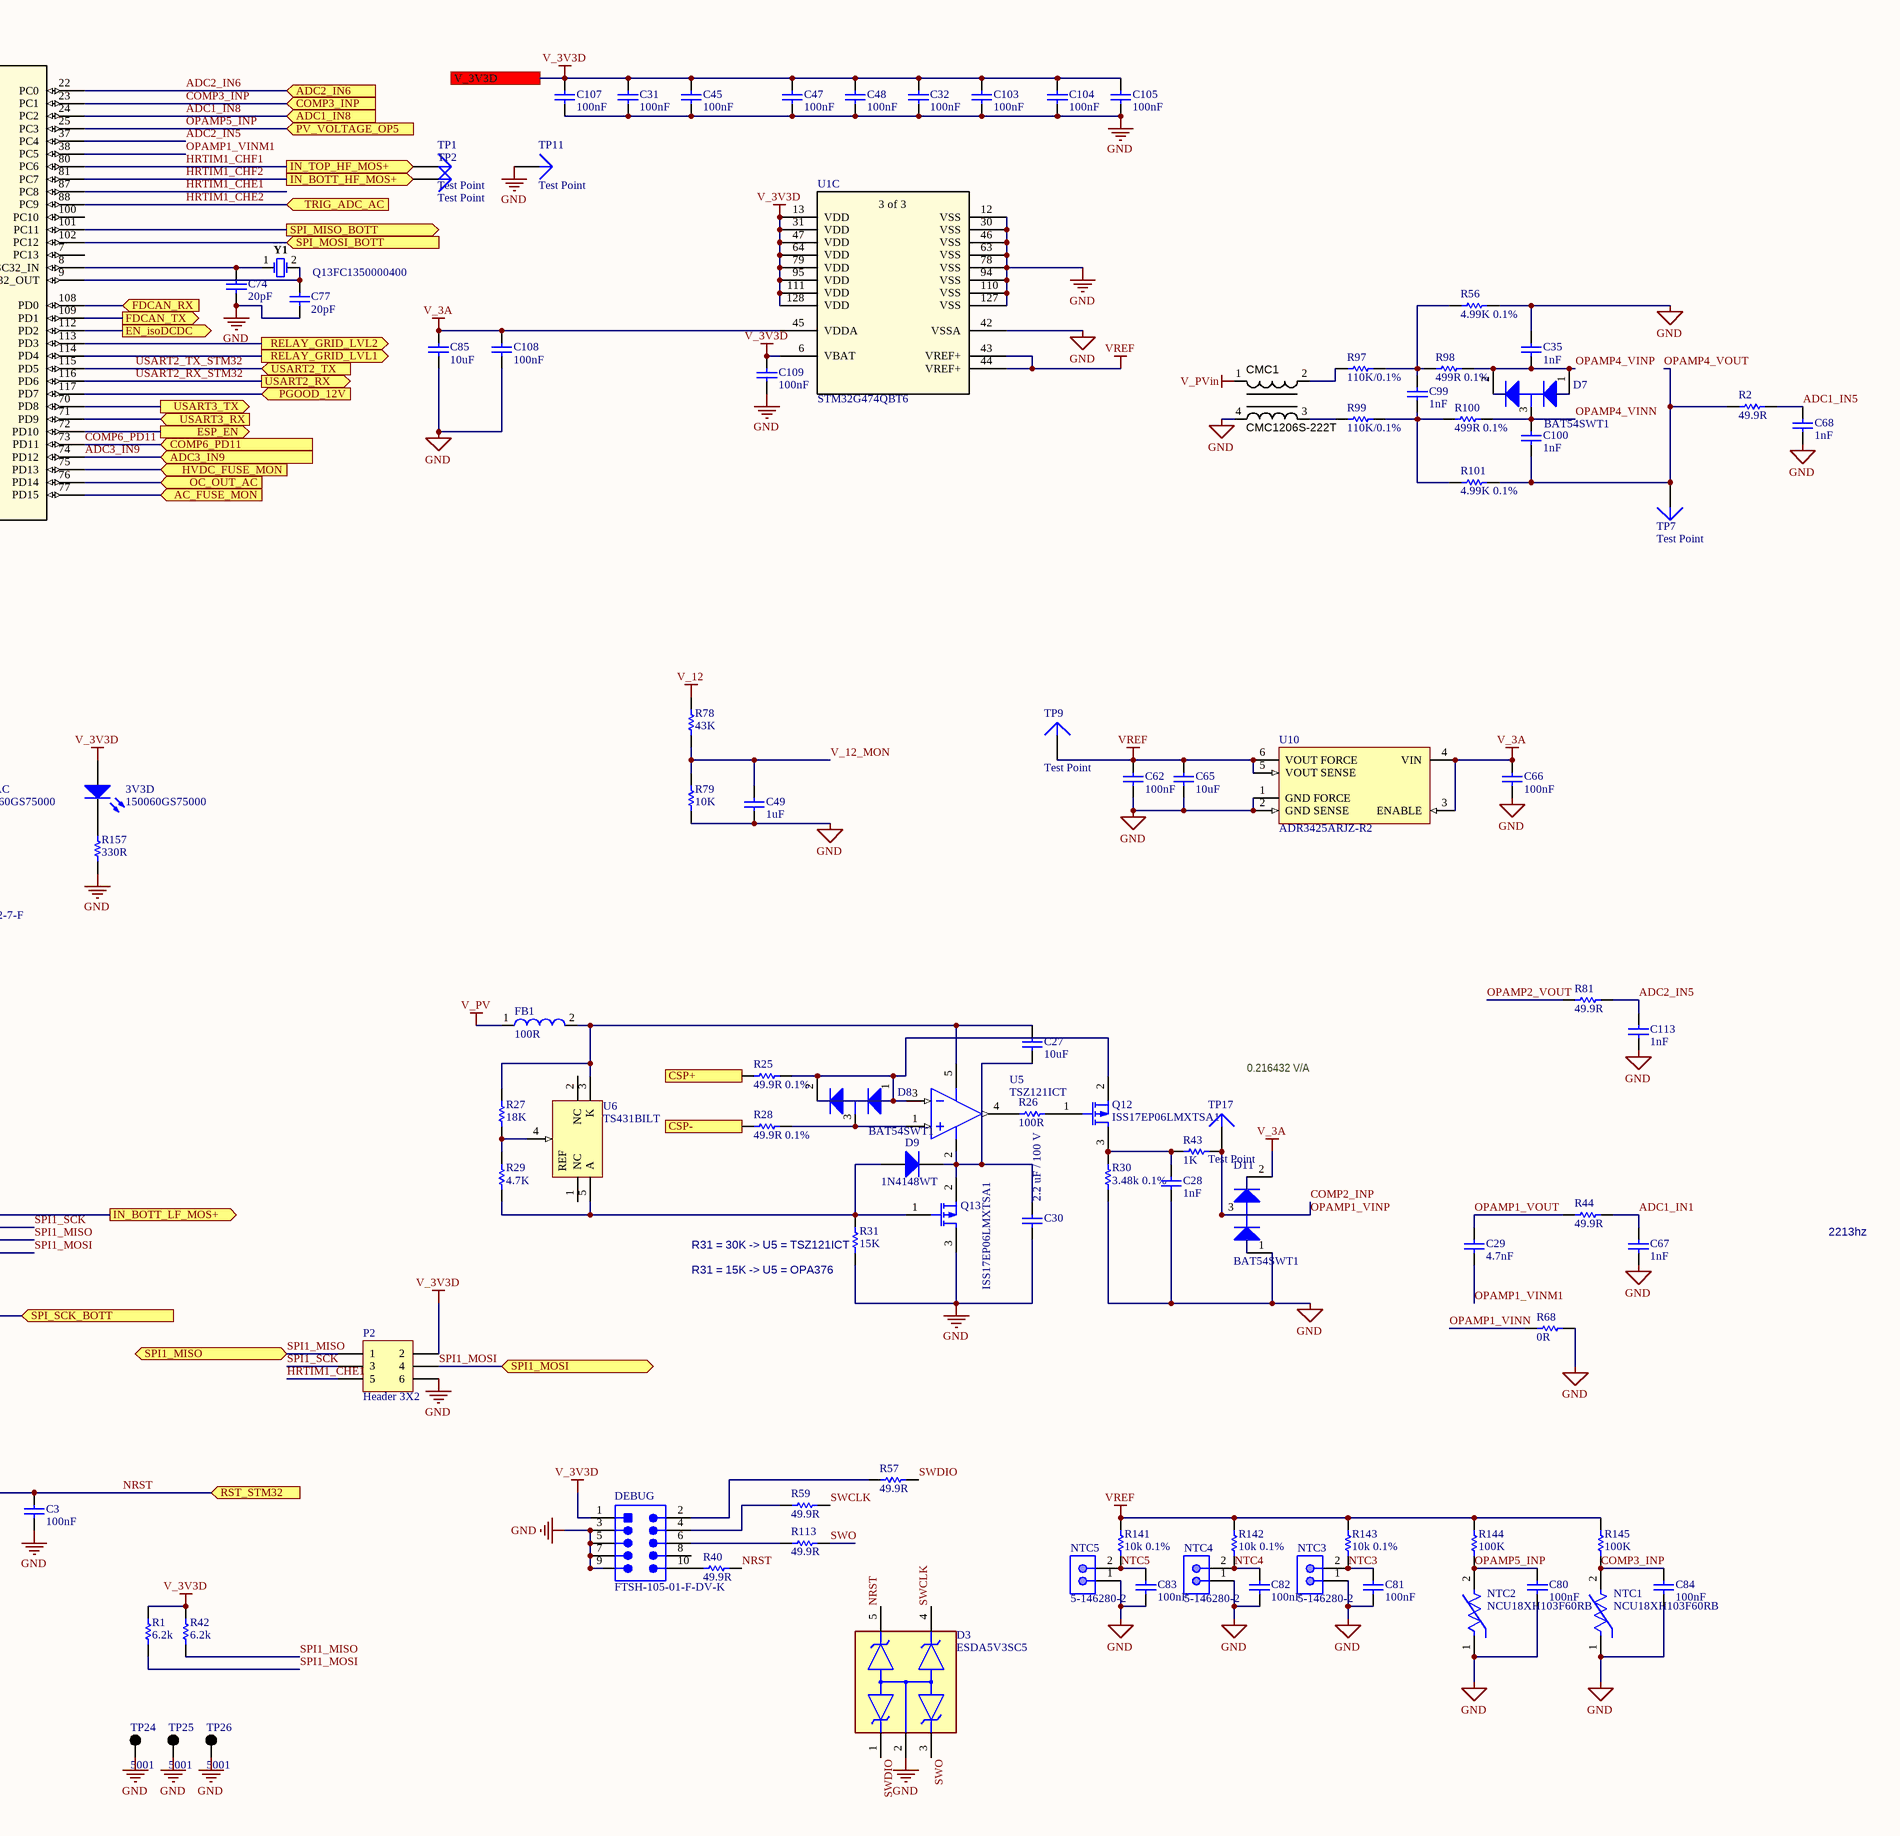
[diagram p2: MCU.SchDoc, right]

### Parts
3V3D  150060GS75000  [0603_A]
C3  100nF  [CAPC1005X56X25NL10T15]
C27  10uF  [CAPC2013X140X45NL15T25]
C28  1nF  [CAPC1608X90X35NL15T15]
C29  4.7nF  [CAPC1608X90X20NL10]
C30  2.2 uF / 100 V  [CAPC3225X250X20LL40]
C31  100nF  [CAPC1608X90X35NL10T15]
C32  100nF  [CAPC1608X90X35NL10T15]
C35  1nF  [CAPC1608X90X35NL15T15]
C45  100nF  [CAPC1608X90X35NL10T15]
C47  100nF  [CAPC1608X90X35NL10T15]
C48  100nF  [CAPC1608X90X35NL10T15]
C49  1uF  [CAPC1608X86X35NL15T15]
C59  6.8pF  [CAPC1005X56X25LL10T15]
C62  100nF  [CAPC1005X56X25NL10T15]
C63  6.8pF  [CAPC1005X56X25LL10T15]
C65  10uF  [CAPC1608X90X40NL10T20]
C66  100nF  [CAPC1608X90X35NL10T15]
C67  1nF  [CAPC1005X56X25NL10T15]
C68  1nF  [CAPC1608X90X35NL15T15]
C74  20pF  [CAPC1005X55X25ML05T10]
C77  20pF  [CAPC1005X55X25ML05T10]
C80  100nF  [CAPC1608X90X35NL10T15]
C81  100nF  [CAPC1608X90X35NL10T15]
C82  100nF  [CAPC1608X90X35NL10T15]
C83  100nF  [CAPC1608X90X35NL10T15]
C84  100nF  [CAPC1608X90X35NL10T15]
C85  10uF  [CAPC2013X140X45NL15T25]
C99  1nF  [CAPC1608X90X35NL15T15]
C100  1nF  [CAPC1608X90X35NL15T15]
C103  100nF  [CAPC1608X90X35NL10T15]
C104  100nF  [CAPC1608X90X35NL10T15]
C105  100nF  [CAPC1608X90X35NL10T15]
C107  100nF  [CAPC1608X90X35NL10T15]
C108  100nF  [CAPC1608X90X35NL10T15]
C109  100nF  [CAPC1608X90X35NL10T15]
C113  1nF  [CAPC1005X56X25NL10T15]
C126  100pF  [CAPC1608X90X35NL10T15]
C127  100pF  [CAPC1608X90X35NL10T15]
CMC1  CMC1206S-222T  [CHOKE_CM_1206SMD]
D3  ESDA5V3SC5  [FP-SOT323-5L-MFG]
D7  BAT54SWT1  [ONSC-SOT-323-3-419-04_V]
D8  BAT54SWT1  [ONSC-SOT-323-3-419-04_V]
D9  1N4148WT  [FAIR-SOD-523F-2_V]
D11  BAT54SWT1  [ONSC-SOT-323-3-419-04_V]
DC/AC  150060GS75000  [0603_A]
DC/DC  150060YS75000  [0603_A]
DEBUG  FTSH-105-01-F-DV-K  [SMTC-FTSH-105-01-L-DV-K_V]
FB1  100R  [SMD-0603]
NTC1  NCU18XH103F60RB  [FP-NCU18-0_15-MFG]
NTC2  NCU18XH103F60RB  [FP-NCU18-0_15-MFG]
NTC3  5-146280-2  [TECO-5-146280-2_V]
NTC4  5-146280-2  [TECO-5-146280-2_V]
NTC5  5-146280-2  [TECO-5-146280-2_V]
P2  Header 3X2  [HDR2X3]
Q12  ISS17EP06LMXTSA1  [INF-PG-SOT23_N]
Q13  ISS17EP06LMXTSA1  [INF-PG-SOT23_N]
Q15  2N7002-7-F  [DIOD-SOT23-3_V]
Q16  2N7002-7-F  [DIOD-SOT23-3_V]
R1  6.2k  [RESC1608X55X25ML10T15]
R2  49.9R  [RESC1608X55X30ML15T15]
R3  10K  [RESC1608X55X25NL10T15]
R25  49.9R 0.1%  [RESC1608X55X25ML10T15]
R26  100R  [RESC1608X55X30LL15T15]
R27  18K  [RESC1608X55X30NL20T20]
R28  49.9R 0.1%  [RESC1608X55X25ML10T15]
R29  4.7K  [RESC1608X55X30ML15T15]
R30  3.48k 0.1%  [RESC1608X55X30NL20T20]
R31  15K  [RESC1608X55X30NL15T15]
R39  0R  [RESC1608X55X25ML10T15]
R40  49.9R  [RESC1608X55X30NL15T15]
R42  6.2k  [RESC1608X55X25ML10T15]
R43  1K  [RESC1608X55X30NL15T15]
R44  49.9R  [RESC1608X55X30NL15T15]
R56  4.99K 0.1%  [RESC1608X55X30ML20T20]
R57  49.9R  [RESC1608X55X30NL15T15]
R59  49.9R  [RESC1608X55X30NL15T15]
R68  0R  [RESC1608X55X25ML10T15]
R78  43K  [RESC1608X55X30NL20T20]
R79  10K  [RESC1608X55X25NL10T15]
R81  49.9R  [RESC1005X40X25NL05T05]
R97  110K/0.1%  [RESC1608X55X30NL20T20]
R98  499R 0.1%  [RESC1608X55N]
R99  110K/0.1%  [RESC1608X55X30NL20T20]
R100  499R 0.1%  [RESC1608X55N]
R101  4.99K 0.1%  [RESC1608X55X30ML20T20]
R107  330R  [RESC1608X55X25NL10T15]
R108  330R  [RESC1608X55X25NL10T15]
R113  49.9R  [RESC1608X55X30NL15T15]
R125  330R  [RESC1608X55X25NL10T15]
R141  10k 0.1%  [RESC1608X55X30ML20T20]
R142  10k 0.1%  [RESC1608X55X30ML20T20]
R143  10k 0.1%  [RESC1608X55X30ML20T20]
R144  100K  [RESC1608X55X25NL10T15]
R145  100K  [RESC1608X55X25NL10T15]
R153  330R  [RESC1608X55X25NL10T15]
R154  330R  [RESC1608X55X25NL10T15]
R155  100K  [RESC1608X55X25ML10T15]
R156  100K  [RESC1608X55X25ML10T15]
R157  330R  [RESC1608X55X25NL10T15]
TP1  Test Point  [TP1.5mm]
TP2  Test Point  [TP1.5mm]
TP3  Test Point  [TP1.5mm]
TP4  Test Point  [TP1.5mm]
TP7  Test Point  [TP1.5mm]
TP9  Test Point  [TP1.5mm]
TP11  Test Point  [TP1.5mm]
TP17  Test Point  [TP1.5mm]
TP18  Test Point  [TP1.5mm]
TP24  5001  [KSTN-5001]
TP25  5001  [KSTN-5001]
TP26  5001  [KSTN-5001]
U1  STM32G474QBT6  [LQFP-128]  (parts A,B,C of 3)
U5  TSZ121ICT  [DCK0005A_N]
U6  TS431BILT  [SOT23-5]
U10  ADR3425ARJZ-R2  [SOT23-6]
X1  NX2016SA-24M-EXS00A-CS08891  [ABRA-ABM11_V]
Y1  Q13FC1350000400  [ABRA-ABS07_A_V]

### Ports
AC_FUSE_MON (in), ADC1_IN8 (in), ADC2_IN6 (in), ADC3_IN9 (in), BOOT0_STM32 (in), COMP1_INP (in), COMP3_INP (in), COMP6_PD11 (in), CSP+ (in), CSP- (in), DAC1_OUT1 (out), EN_isoDCDC (out), ESP_EN (out), ESP_GPIO0 (out), FDCAN_RX (in), FDCAN_TX (out), HRTIM1_CHA1 (out), HRTIM1_CHA2 (out), HRTIM1_CHB1 (out), HRTIM1_CHB2 (out), HRTIM_FLT4 (in), HRTIM_FLT4 (out), HVDC_FUSE_MON (in), IN_BOTT_HF_MOS+ (out), IN_BOTT_LF_MOS+ (out), IN_TOP_HF_MOS+ (out), IN_TOP_LF_MOS+ (out), OC_OUT_AC (in), OC_OUT_BOTT (in), OPAMP1_VINP/COMP1 (in), OPAMP2_VINP (in), OPAMP4_VINN (in), OPAMP4_VINP (in), OPAMP4_VOUT (in), PGOOD_5V (in), PGOOD_12V (in), PV_VOLTAGE_OP5 (in), PWM_isoDCDC (out), RELAY_GRID (out), RELAY_GRID_LVL1 (in), RELAY_GRID_LVL1 (out), RELAY_GRID_LVL2 (in), RELAY_GRID_LVL2 (out), RELAY_SENSE (in), RST_STM32 (in), SPI1_MISO (bidir), SPI1_MOSI (bidir), SPI_MISO_AC (in), SPI_MISO_BOTT (out), SPI_MOSI_AC (out), SPI_MOSI_BOTT (in), SPI_SCK_AC (out), SPI_SCK_BOTT (in), STATUS1 (in), STATUS2 (in), TRIG_ADC_AC (in), TWO_LEVEL_OFF1_TOP_MOS (in), TWO_LEVEL_OFF2_TOP_MOS (in), USART1_RX (in), USART1_TX (out), USART2_RX (out), USART2_TX (in), USART3_RX (in), USART3_TX (out), UV_TOP_HF_MOS (out), UV_TOP_LF_MOS (out), V_3V3D

### Nets
GND: C3.1 C28.1 C30.1 C31.1 C32.1 C35.2 C45.1 C47.1 C48.1 C49.1 C59.1 C62.1 C63.1 C65.1 C66.1 C67.1 C68.1 C74.1 C77.1 C80.1 C81.1 C82.1 C83.1 C84.1 C85.1 C103.1 C104.1 C105.1 C107.1 C108.1 C109.1 C113.1 C126.1 C127.1 CMC1.4 D3.2(COMMON_ANODE) D11.1(A) DEBUG.3 DEBUG.5 DEBUG.7 DEBUG.9 NTC1.1 NTC2.1 NTC3.1 NTC4.1 NTC5.1 P2.6 Q13.3(D) Q15.2(S) Q16.2(S) R3.1 R30.1 R31.1 R56.1 R68.1 R79.1 R155.1 R156.1 R157.2 TP11.1 TP24.1 TP25.1 TP26.1 U1.12(VSS) U1.30(VSS) U1.42(VSSA) U1.46(VSS) U1.63(VSS) U1.78(VSS) U1.94(VSS) U1.110(VSS) U1.127(VSS) U10.1(GND_FORCE) U10.2(GND_SENSE) X1.2(GND) X1.4(GND)
V_3A: C66.2 C85.2 C108.2 D11.2(K) U1.45(VDDA) U10.3(ENABLE) U10.4(VIN)
V_3V3D: 3V3D.2(A) C31.2 C32.2 C45.2 C47.2 C48.2 C103.2 C104.2 C105.2 C107.2 C109.2 DC/AC.2(A) DC/DC.2(A) DEBUG.1 P2.2 R1.1 R42.1 U1.6(VBAT) U1.13(VDD) U1.31(VDD) U1.47(VDD) U1.64(VDD) U1.79(VDD) U1.95(VDD) U1.111(VDD) U1.128(VDD) ; port V_3V3D
V_12: R78.2
V_PV: FB1.1 R28.1 ; port CSP-
V_PVin: CMC1.1 R25.1 ; port CSP+
VREF: C62.2 C65.2 R141.2 R142.2 R143.2 R144.2 R145.2 TP9.1 U1.43(VREF+) U1.44(VREF+) U10.5(VOUT_SENSE) U10.6(VOUT_FORCE)
ADC1_IN1: C67.2 R44.2 U1.27(PA0)
ADC1_IN5: C68.2 R2.2 U1.68(PB14)
ADC1_IN8: U1.24(PC2) ; port ADC1_IN8
ADC2_IN5: C113.2 R81.2 U1.37(PC4)
ADC2_IN6: U1.22(PC0) ; port ADC2_IN6
ADC3_IN9: C127.2 R108.2 U1.74(PD12) ; port ADC3_IN9
BOOT0_STM32: R3.2 U1.123(PB8-BOOT0) ; port BOOT0_STM32
COMP1_INP: U1.39(PB0) U1.40(PB1) ; port OPAMP2_VINP, port COMP1_INP  [also labelled COMP4_INP, OPAMP2_VINP]
COMP2_INP: D11.3(K/A) R43.1 TP17.1 U1.28(PA1) U1.36(PA7) ; port OPAMP1_VINP/COMP1  [also labelled OPAMP1_VINP]
COMP3_INP: C84.2 NTC1.2 R145.1 U1.23(PC1) ; port COMP3_INP
COMP6_PD11: C126.2 R107.2 U1.73(PD11) ; port COMP6_PD11
DAC1_OUT1: R39.2 ; port DAC1_OUT1
DAC1_OUT2: U1.34(PA5) ; port RELAY_GRID
HRTIM1_CHA1: U1.89(PA8) ; port HRTIM1_CHA1
HRTIM1_CHA2: U1.90(PA9) ; port HRTIM1_CHA2
HRTIM1_CHB1: U1.91(PA10) ; port HRTIM1_CHB1
HRTIM1_CHB2: U1.92(PA11) ; port HRTIM1_CHB2
HRTIM1_CHE1: P2.5 U1.87(PC8)
HRTIM1_CHE2: U1.88(PC9) ; port TRIG_ADC_AC
HRTIM1_CHF1: TP1.1 U1.80(PC6) ; port IN_TOP_HF_MOS+
HRTIM1_CHF2: TP2.1 U1.81(PC7) ; port IN_BOTT_HF_MOS+
NRST: C3.2 D3.5(4_CATHODE) R40.2 U1.21(PG10-NRST) ; port RST_STM32
NTC3: C81.2 NTC3.2 R143.1 U1.57(PE11)
NTC4: C82.2 NTC4.2 R142.1 U1.56(PE10)
NTC5: C83.2 NTC5.2 R141.1 U1.54(PE8)
OPAMP1_VINM1: C29.1 U1.38(PC5)
OPAMP1_VINN: R68.2 U1.32(PA3)
OPAMP1_VOUT: C29.2 R44.1 U1.29(PA2)
OPAMP2_VOUT: R81.1 U1.35(PA6)
OPAMP4_VINN: C100.2 D7.3(K/A) R100.2 U1.62(PB10) ; port OPAMP4_VINN
OPAMP4_VINP: C35.1 D7.1(A) D7.2(K) R98.2 U1.67(PB13) ; port OPAMP4_VINP
OPAMP4_VOUT: C100.1 R2.1 R101.1 TP7.1 U1.66(PB12) ; port OPAMP4_VOUT
OPAMP5_INP: C80.2 NTC2.2 R144.1 U1.25(PC3) ; port PV_VOLTAGE_OP5
SPI1_MISO: P2.1 R42.2 U1.85(PG3) ; port SPI1_MISO
SPI1_MOSI: P2.4 R1.2 U1.86(PG4) ; port SPI1_MOSI
SPI1_SCK: P2.3 U1.84(PG2)
SWCLK: D3.4(3_CATHODE) R59.2 U1.98(PA14)
SWDIO: D3.1(1_CATHODE) R57.2 U1.96(PA13)
SWO: D3.3(2_CATHODE) R113.2 U1.118(PB3)
USART2_RX_STM32: U1.116(PD6) ; port USART2_RX
USART2_TX_STM32: U1.115(PD5) ; port USART2_TX
V_12_MON: C49.2 R78.1 R79.2 U1.53(PE7)
Net3V3D_1: 3V3D.1(K) R157.1
NetC27_1: C27.1 FB1.2 R27.2 U5.5(V+) U6.3(K)
NetC27_2: C27.2 C30.2 D9.1(K) Q13.2(S) U5.2(V-)
NetC28_2: C28.2 Q12.3(D) R30.2 R43.2
NetC59_2: C59.2 U1.19(PF0-OSC_IN) X1.1(X1)
NetC63_2: C63.2 U1.20(PF1-OSC_OUT) X1.3(X2)
NetC74_2: C74.2 U1.8(PC14-OSC32_IN) Y1.1
NetC77_2: C77.2 U1.9(PC15-OSC32_OUT) Y1.2
NetC89_2: U1.75(PD13) ; port HVDC_FUSE_MON
NetC95_2: U1.99(PA15) ; port UV_TOP_HF_MOS, port UV_TOP_LF_MOS
NetC99_1: C99.1 R99.1 R100.1 R101.2
NetC99_2: C99.2 R56.2 R97.1 R98.1
NetC130_2: U1.77(PD15) ; port AC_FUSE_MON
NetCMC1_2: CMC1.2 R97.2
NetCMC1_3: CMC1.3 R99.2
NetCONN_BOTT_3: U1.101(PC11) ; port SPI_MISO_BOTT
NetCONN_BOTT_4: U1.107(PG9) ; port SPI_SCK_BOTT
NetCONN_BOTT_6: U1.102(PC12) ; port SPI_MOSI_BOTT
NetCONN_BOTT_12: U1.83(PG1) ; port IN_BOTT_LF_MOS+
NetCONN_IND_1: U1.5(PE6) ; port SPI_MOSI_AC
NetCONN_IND_3: U1.4(PE5) ; port SPI_MISO_AC
NetCONN_IND_5: U1.1(PE2) ; port SPI_SCK_AC
NetCONN_REL_3: R107.1 R108.1 ; port RELAY_SENSE
NetD8_1: D8.1(A) D8.2(K) Q12.2(S) R25.2 U5.3(IN-)
NetD8_3: D8.3(K/A) R28.2 U5.1(IN+)
NetD9_2: D9.2(A) Q13.1(G) R29.1 R31.2 U6.5(A)
NetDC/AC_1: DC/AC.1(K) R154.1
NetDC/DC_1: DC/DC.1(K) R153.1
NetDEBUG_2: DEBUG.2 R57.1
NetDEBUG_4: DEBUG.4 R59.1
NetDEBUG_6: DEBUG.6 R113.1
NetDEBUG_10: DEBUG.10 R40.1
NetESP_PROG_2: U1.69(PB15) ; port ESP_GPIO0
NetESP_PROG_3: U1.71(PD9) ; port USART3_RX
NetESP_PROG_4: U1.70(PD8) ; port USART3_TX
NetQ12_1: Q12.1(G) R26.2
NetQ15_1: Q15.1(G) R155.2 U1.50(PF13) ; port STATUS1
NetQ15_3: Q15.3(D) R153.2
NetQ16_1: Q16.1(G) R156.2 U1.48(PF11) ; port STATUS2
NetQ16_3: Q16.3(D) R154.2
NetR26_1: R26.1 U5.4(OUT)
NetR27_1: R27.1 R29.2 U6.4(REF)
NetR34_1: U1.59(PE13) ; port TWO_LEVEL_OFF1_TOP_MOS
NetR39_1: R39.1 U1.33(PA4)
NetR41_1: U1.3(PE4) ; port PGOOD_5V
NetR70_2: U1.61(PE15) ; port OC_OUT_BOTT
NetR77_2: U1.124(PB9) ; port PWM_isoDCDC
NetR94_2: U1.72(PD10) ; port ESP_EN
NetR106_2: U1.112(PD2) ; port EN_isoDCDC
NetR111_2: TP3.1 U1.114(PD4) ; port RELAY_GRID_LVL1
NetR116_2: U1.76(PD14) ; port OC_OUT_AC
NetR118_1: U1.117(PD7) ; port PGOOD_12V
NetR125_1: R125.1 TP18.1 U1.58(PE12) ; port TWO_LEVEL_OFF2_TOP_MOS
NetR125_2: R125.2 U1.65(PB11) ; port HRTIM_FLT4
NetR126_1: TP4.1 U1.113(PD3) ; port RELAY_GRID_LVL2
NetR129_2: U1.126(PE1) ; port USART1_RX
NetR130_2: U1.125(PE0) ; port USART1_TX
NetU1_2: U1.2(PE3) ; port IN_TOP_LF_MOS+
NetU1_108: U1.108(PD0) ; port FDCAN_RX
NetU1_109: U1.109(PD1) ; port FDCAN_TX

Not connected (* = marked no-connect by the designer): DEBUG 8; U1 7(PC13) 10(PF3) 11(PF4) 14(PF5) 15(PF7) 16(PF8) 17(PF9) 18(PF10) 26(PF2) 41(PB2) 49(PF12) 51(PF14) 52(PF15) 55(PE9) 60(PE14) 82(PG0) 93(PA12) 97(PF6) 100(PC10) 103(PG5) 104(PG6) 105(PG7) 106(PG8) 119(PB4) 120(PB5) 121(PB6) 122(PB7); U6 1(NC) 2(NC)

### Notes on the sheet
- 0.216432 V/A
- (near R31) R31 = 30K -> U5 = TSZ121ICT
- (near R31) R31 = 15K -> U5 = OPA376
- 2213hz
- (in symbol STM32G4_LPQFP128, part A) 1 of 2
- (in symbol STM32G4_LPQFP128, part B) 2 of 2
- (in symbol STM32G4_LPQFP128, part C) 3 of 3